# EAGLE design sunkbd-no-ISP (EAGLE 5.10)
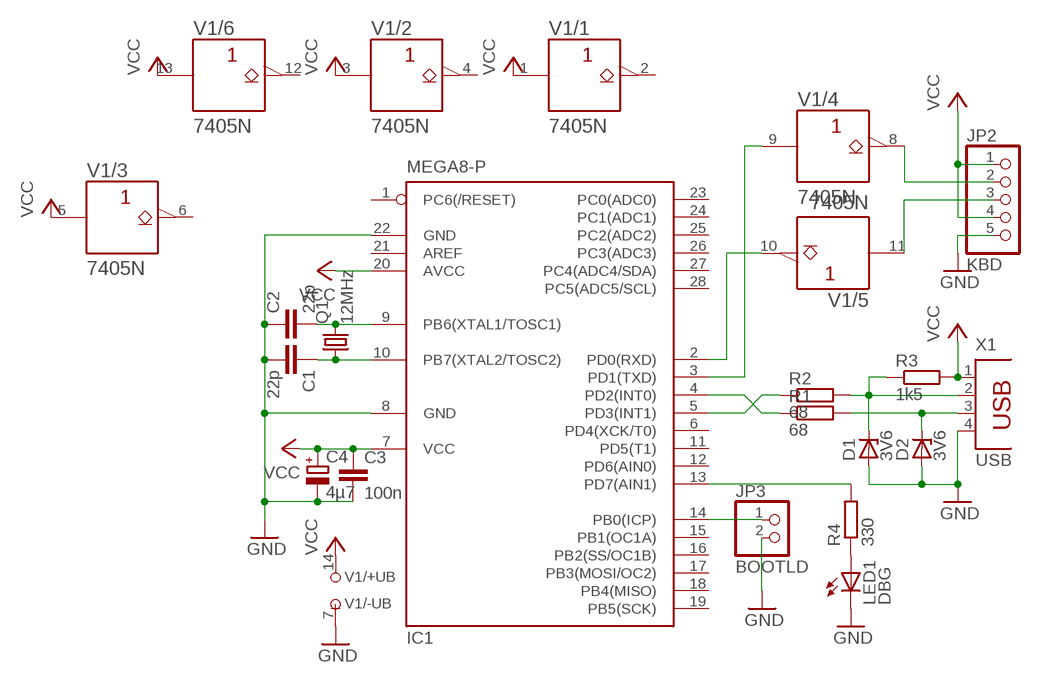
[diagram p0: schematic, sheet 1]

## Parts
C1  22p  C-EU025-024X044  [C025-024X044]
C2  22p  C-EU025-024X044  [C025-024X044]
C3  100n  C-EU050-024X044  [C050-024X044]
C4  4µ7  CPOL-EUE2.5-5  [E2,5-5]
D1  3V6  ZENER-DIODEDO34-7  [DO34Z7]
D2  3V6  ZENER-DIODEDO35Z10  [DO35Z10]
IC1  MEGA8-P  [DIL28-3]
JP2  KBD  PINHD-1X5/90  [1X05/90]
JP3  BOOTLD  PINHD-1X2  [1X02]
LED1  DBG  LED3MM  [LED3MM]
Q1  12MHz  CRYSTALHC49S  [HC49/S]
R1  68  R-EU_0207/10  [0207/10]
R2  68  R-EU_0207/15  [0207/15]
R3  1k5  R-EU_0207/12  [0207/12]
R4  330  R-EU_0207/10  [0207/10]
V1  7405N  [DIL14]
X1  USB  PN61729  [PN61729]

## Nets
GND: C1.2 C2.1 C3.2 C4.- D1.A D2.A IC1.8(GND) IC1.22(GND) JP2.5 JP3.2 LED1.K(C) V1.7(/-UB:-UB) X1.4
N$1: C2.2 IC1.9(PB6(XTAL1/TOSC1)) Q1.2
N$2: C1.1 IC1.10(PB7(XTAL2/TOSC2)) Q1.1
N$3: JP2.2 V1.8(/4:Y)
N$4: JP2.3 V1.11(/5:A)
N$5: IC1.5(PD3(INT1)) R2.1
N$6: IC1.4(PD2(INT0)) R1.1
N$7: D2.C R1.2 X1.3
N$8: IC1.2(PD0(RXD)) V1.10(/5:Y)
N$9: IC1.14(PB0(ICP)) JP3.1
N$10: IC1.3(PD1(TXD)) V1.9(/4:A)
N$11: D1.C R2.2 R3.1 X1.2
N$12: IC1.13(PD7(AIN1)) R4.2
N$13: LED1.A R4.1
VCC: C3.1 C4.+ IC1.7(VCC) IC1.20(AVCC) JP2.1 JP2.4 R3.2 V1.1(/1:A) V1.3(/2:A) V1.5(/3:A) V1.13(/6:A) V1.14(/+UB:+UB) X1.1
Unconnected: IC1.1(PC6(/RESET)) IC1.6(PD4(XCK/T0)) IC1.11(PD5(T1)) IC1.12(PD6(AIN0)) IC1.15(PB1(OC1A)) IC1.16(PB2(SS/OC1B)) IC1.17(PB3(MOSI/OC2)) IC1.18(PB4(MISO)) IC1.19(PB5(SCK)) IC1.21(AREF) IC1.23(PC0(ADC0)) IC1.24(PC1(ADC1)) IC1.25(PC2(ADC2)) IC1.26(PC3(ADC3)) IC1.27(PC4(ADC4/SDA)) IC1.28(PC5(ADC5/SCL)) V1.2(/1:Y) V1.4(/2:Y) V1.6(/3:Y) V1.12(/6:Y)

## Library data of the parts
C1-C3 = rcl:C-EU: CAPACITOR, European symbol
C4 = rcl:CPOL-EU: POLARIZED CAPACITOR, European symbol
D1 D2 = diode:ZENER-DIODE: Z-Diode
IC1 = atmel:MEGA8-P: MICROCONTROLLER 8 Kbytes FLASH, 1 kbytes SRAM, 512 bytes EEPROM, USART, 4-channel 10 bit ADC, 2-channel 8 bit ADC Pin compatible with Atmega48, ATMega88, ATMega168 Source: avr.lbr
JP2 = pinhead:PINHD-1X5: PIN HEADER
JP3 = pinhead:PINHD-1X2: PIN HEADER
LED1 = led:LED: LED OSRAM: - CHIPLED LG R971, LG N971, LY N971, LG Q971, LY Q971, LO R971, LY R971 LH N974, LH R974 LS Q976, LO Q976, LY Q976 LO Q996 - Hyper CHIPLED LW Q18S LB Q993, LB Q99A, LB R99A - SideLED LS A670, LO A670, LY A670, LG A670, LP A670 LB A673, LV A673, LT A673, LW A673 LH A674 LY A675 LS A676, LA A676, LO A676, LY A676, LW A676 LS A679, LY A679, LG A679 - Hyper Micro SIDELED® LS Y876, LA Y876, LO Y876, LY Y876 LT Y87S - SmartLED LW L88C, LW L88S LB L89C, LB L89S, LG L890 LS L89K, LO L89K, LY L89K LS L896, LA L896, LO L896, LY L896 - TOPLED LS T670, LO T670, LY T670, LG T670, LP T670 LSG T670, LSP T670, LSY T670, LOP T670, LYG T670 LG T671, LOG T671, LSG T671 LB T673, LV T673, LT T673, LW T673 LH T674 LS T676, LA T676, LO T676, LY T676, LB T676, LH T676, LSB T676, LW T676 LB T67C, LV T67C, LT T67C, LS T67K, LO T67K, LY T67K, LW E67C LS E67B, LA E67B, LO E67B, LY E67B, LB E67C, LV E67C, LT E67C LW T67C LS T679, LY T679, LG T679 LS T770, LO T770, LY T770, LG T770, LP T770 LB T773, LV T773, LT T773, LW T773 LH T774 LS E675, LA E675, LY E675, LS T675 LS T776, LA T776, LO T776, LY T776, LB T776 LHGB T686 LT T68C, LB T68C - Hyper Mini TOPLED® LB M676 - Mini TOPLED Santana® LG M470 LS M47K, LO M47K, LY M47K Source: http://www.osram.convergy.de LUXEON: - LUMILED® LXK2-PW12-R00, LXK2-PW12-S00, LXK2-PW14-U00, LXK2-PW14-V00 LXK2-PM12-R00, LXK2-PM12-S00, LXK2-PM14-U00 LXK2-PE12-Q00, LXK2-PE12-R00, LXK2-PE12-S00, LXK2-PE14-T00, LXK2-PE14-U00 LXK2-PB12-K00, LXK2-PB12-L00, LXK2-PB12-M00, LXK2-PB14-N00, LXK2-PB14-P00, LXK2-PB14-Q00 LXK2-PR12-L00, LXK2-PR12-M00, LXK2-PR14-Q00, LXK2-PR14-R00 LXK2-PD12-Q00, LXK2-PD12-R00, LXK2-PD12-S00 LXK2-PH12-R00, LXK2-PH12-S00 LXK2-PL12-P00, LXK2-PL12-Q00, LXK2-PL12-R00 Source: www.luxeon.com KINGBRIGHT: KA-3528ASYC Source: www.kingbright.com
Q1 = crystal:CRYSTAL: CRYSTAL
R1-R3 = rcl:R-EU_: RESISTOR, European symbol
R4 = resistor:R-EU_: RESISTOR, European symbol
V1 = 74ttl-din:74*05: Hex INVERTER, open collector
X1 = con-berg:PN61729: BERG USB connector

## Board
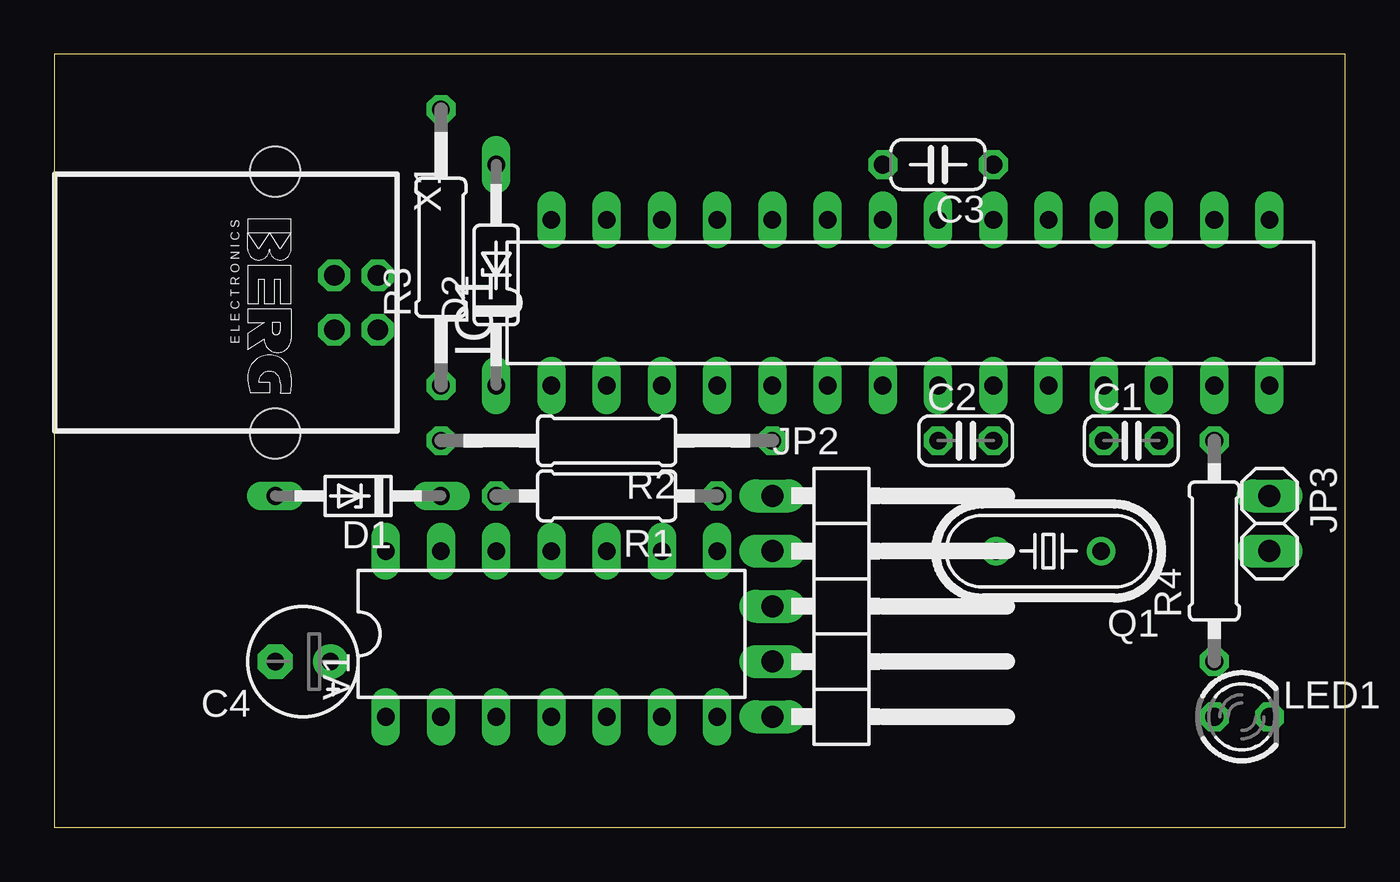
[diagram p1: board, top side]
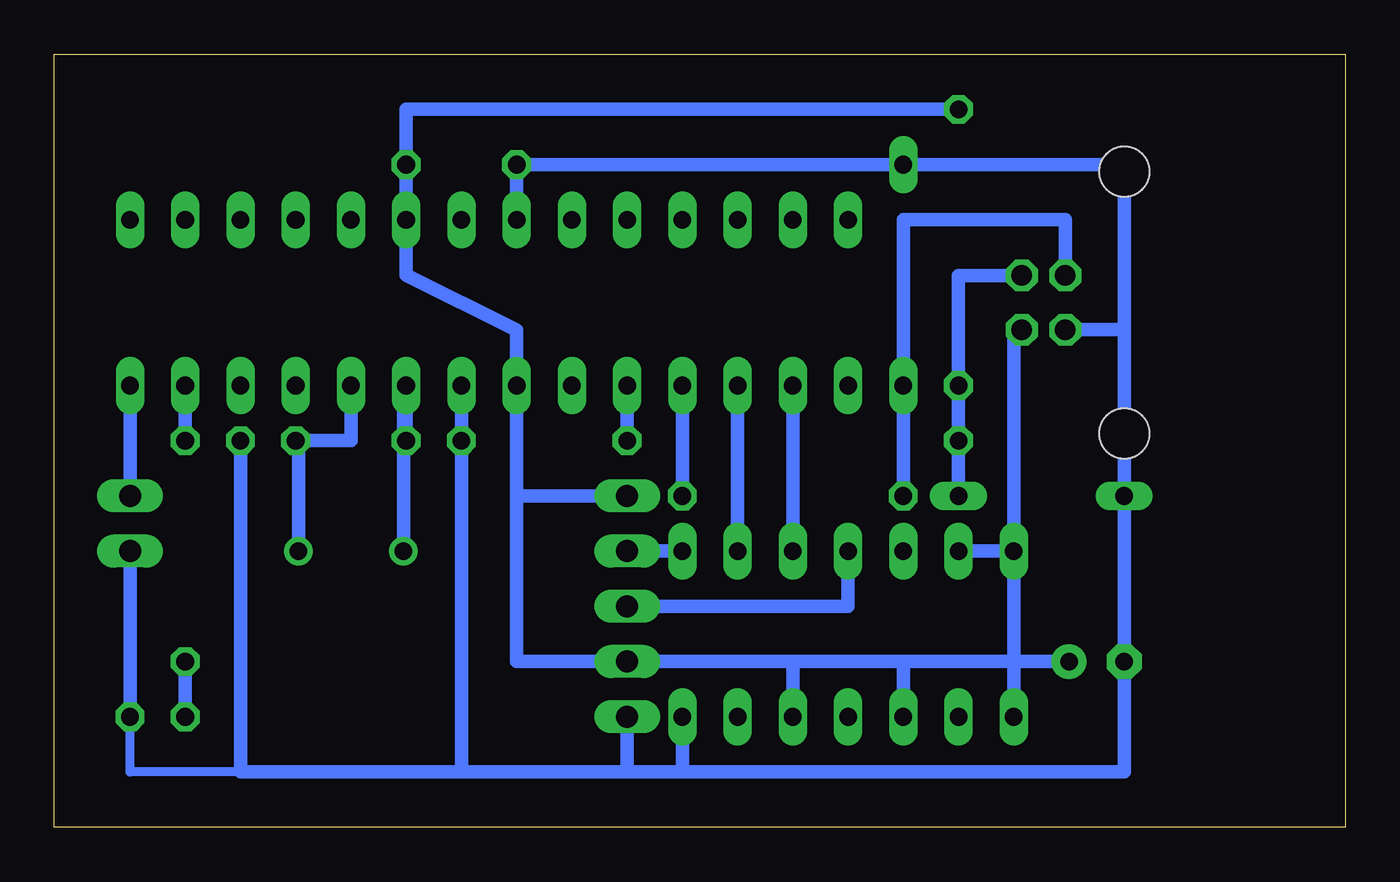
[diagram p2: board, bottom side, seen from below]

Size 59.36 x 35.55 mm. Coordinates in mm from the lower left corner, seen from the top.
Outline: 0,0 59.36,0 59.36,35.55 0,35.55 0,0
Copper layers (1*16): Top 0.035mm / dielectric 1.5mm / Bottom 0.035mm
Design rules "default": minimum track width 10mil, minimum drill 24mil, track to track 8mil, track to pad 8mil, pad to pad 8mil, via to via 8mil, smd to smd 8mil, copper to edge 40mil, drill to drill 8mil, minimum pad ring 10mil, minimum via ring 8mil, stop-mask expansion 4mil, vias tented up to drill 0mil, thermal gap 10mil

### Footprints (pad centres in the part's own frame; a part is rotated, then mirrored left to right if it is on the bottom)
C025-024X044 = drill 0.813 octagon: 1 -1.27,0; 2 1.27,0
C050-024X044 = drill 0.813 octagon: 1 -2.54,0; 2 2.54,0
E2,5-5 = drill 0.813 pad 1.6 round: + -1.27,0 | drill 0.813 pad 1.6 octagon: - 1.27,0
DO34Z7 = drill 0.813 long: A 3.81,0; C -3.81,0
DO35Z10 = drill 0.813 long: A 5.08,0; C -5.08,0
DIL28-3 = drill 0.813 long: 1 -16.51,-3.81; 2 -13.97,-3.81; 3 -11.43,-3.81; 4 -8.89,-3.81; 5 -6.35,-3.81; 6 -3.81,-3.81; 7 -1.27,-3.81; 8 1.27,-3.81; 9 3.81,-3.81; 10 6.35,-3.81; 11 8.89,-3.81; 12 11.43,-3.81; 13 13.97,-3.81; 14 16.51,-3.81; 15 16.51,3.81; 16 13.97,3.81; 17 11.43,3.81; 18 8.89,3.81; 19 6.35,3.81; 20 3.81,3.81; 21 1.27,3.81; 22 -1.27,3.81; 23 -3.81,3.81; 24 -6.35,3.81; 25 -8.89,3.81; 26 -11.43,3.81; 27 -13.97,3.81; 28 -16.51,3.81
1X05/90 = drill 1.016 long: 1 -5.08,-3.81; 2 -2.54,-3.81; 3 0,-3.81; 4 2.54,-3.81; 5 5.08,-3.81
1X02 = drill 1.016 long: 1 -1.27,0; 2 1.27,0
LED3MM = drill 0.813 octagon: A -1.27,0; K 1.27,0
HC49/S = drill 0.813 round: 1 -2.413,0; 2 2.413,0
0207/10 = drill 0.813 octagon: 1 -5.08,0; 2 5.08,0
0207/15 = drill 0.813 octagon: 1 -7.62,0; 2 7.62,0
0207/12 = drill 0.813 octagon: 1 -6.35,0; 2 6.35,0
DIL14 = drill 0.813 long: 1 -7.62,-3.81; 2 -5.08,-3.81; 3 -2.54,-3.81; 4 0,-3.81; 5 2.54,-3.81; 6 5.08,-3.81; 7 7.62,-3.81; 8 7.62,3.81; 9 5.08,3.81; 10 2.54,3.81; 11 0,3.81; 12 -2.54,3.81; 13 -5.08,3.81; 14 -7.62,3.81
PN61729 = drill 0.95 octagon: 1 1.25,4.71; 2 -1.25,4.71; 3 -1.25,2.71; 4 1.25,2.71 | hole 2.3: -6.02,0; 6.02,0

### Placement (x,y rotation side)
C1  49.53,17.78 0 top
C2  41.91,17.78 0 top
C3  40.64,30.48 180 top
C4  11.43,7.62 180 top
D1  13.97,15.24 180 top
D2  20.32,25.4 90 top
IC1  39.37,24.13 0 top
JP2  36.83,10.16 270 top
JP3  55.88,13.97 270 top
LED1  54.61,5.08 0 top
Q1  45.72,12.7 180 top
R1  25.4,15.24 180 top
R2  25.4,17.78 180 top
R3  17.78,26.67 90 top
R4  53.34,12.7 90 top
V1  22.86,8.89 0 top
X1  10.16,24.13 270 top

### Tracks (layer width: path | path; a pad name or v marks a point on that pad's centre or on a via)
GND
  Bottom 0.406: 50.8,2.54 55.88,2.54 LED1.K
  Bottom 0.61: 30.48,2.54 10.16,2.54 C4.- D1.A 10.16,22.88 | 30.48,2.54 V1.7 | IC1.22 C3.2 D2.A 10.16,30.48 10.16,22.88 | 40.64,2.54 C2.1 IC1.8 | 10.16,22.88 X1.4 | 33.02,2.54 JP2.5 | 30.48,2.54 33.02,2.54 | 33.02,2.54 40.64,2.54 | 40.64,2.54 50.8,2.54 C1.2 | LED1.K JP3.2
N$1
  Bottom 0.406: 43.31,20.32 IC1.9
  Bottom 0.61: Q1.2 43.31,20.32 | IC1.9 C2.2
N$2
  Bottom 0.406: 48.13,17.78 C1.1
  Bottom 0.61: IC1.10 45.72,17.78 C1.1 | Q1.1 48.13,17.78
N$3
  Bottom 0.61: V1.8 JP2.2
N$4
  Bottom 0.61: V1.11 22.86,10.16 JP2.3
N$5
  Bottom 0.61: R2.1 IC1.5
N$6
  Bottom 0.61: R1.1 IC1.4
N$7
  Bottom 0.61: D2.C R1.2 20.32,27.94 12.87,27.94 X1.3
N$8
  Bottom 0.61: V1.10 IC1.2
N$9
  Bottom 0.61: JP3.1 IC1.14
N$10
  Bottom 0.61: V1.9 IC1.3
N$11
  Bottom 0.61: X1.2 17.78,25.38 R3.1 D1.C R2.2
N$12
  Bottom 0.61: R4.2 IC1.13
N$13
  Bottom 0.61: LED1.A R4.1
VCC
  Bottom 0.61: 15.24,7.62 C4.+ | 15.24,7.62 V1.14 | X1.1 15.24,22.88 V1.14 | 38.1,15.24 JP2.1 | 15.24,7.62 20.32,7.62 | 20.32,7.62 25.4,7.62 | 25.4,7.62 JP2.4 38.1,7.62 38.1,15.24 | 38.1,15.24 IC1.7 38.1,22.86 43.18,25.4 IC1.20 C3.1 43.18,33.02 R3.2 | V1.1 15.24,7.62 | V1.14 V1.13 | 20.32,7.62 V1.3 | 25.4,7.62 V1.5